# EAGLE design 32_ch_sample_and_hold_v2 (EAGLE 7.2.0)
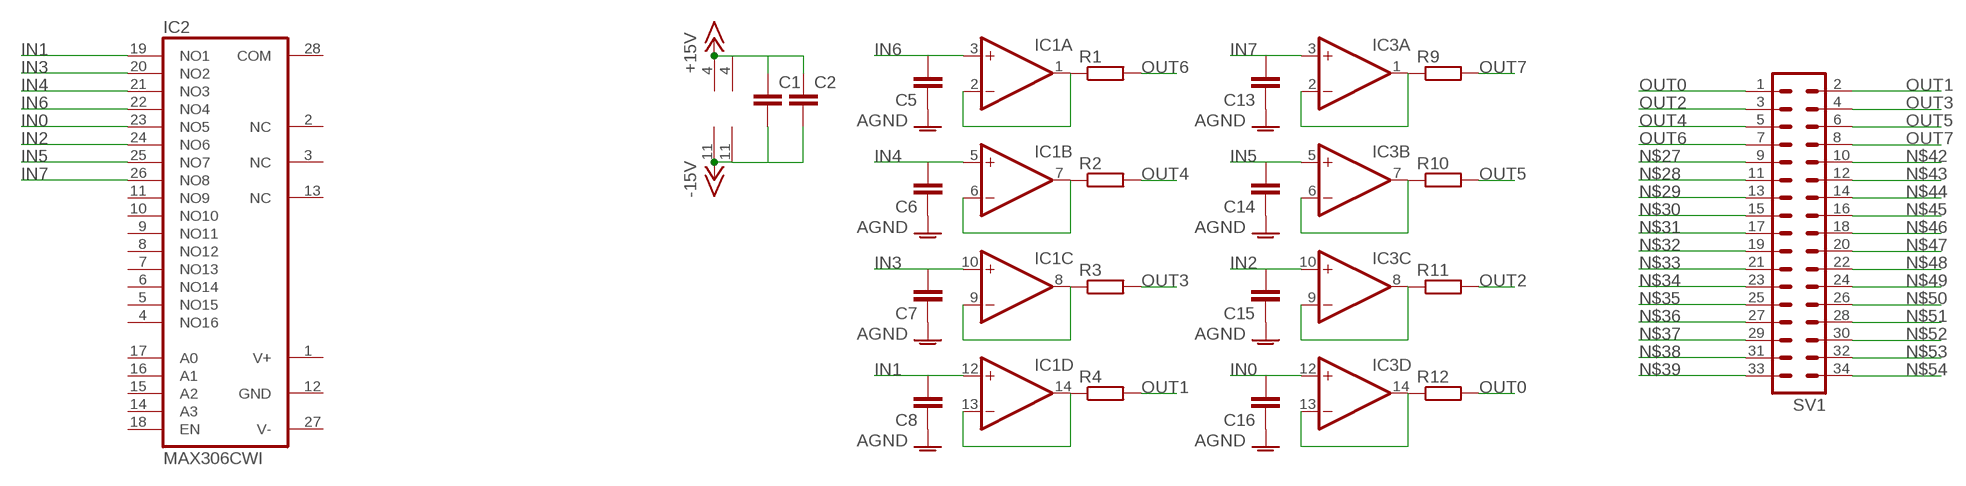
[diagram p0: schematic, sheet 1]

## Parts
C1  C-EUC0603  [C0603]
C2  C-EUC0603  [C0603]
C5  C-EUC1206  [C1206]
C6  C-EUC1206  [C1206]
C7  C-EUC1206  [C1206]
C8  C-EUC1206  [C1206]
C13  C-EUC1206  [C1206]
C14  C-EUC1206  [C1206]
C15  C-EUC1206  [C1206]
C16  C-EUC1206  [C1206]
IC1  TL074D  [SO14]
IC2  MAX306CWI  [SO28L]
IC3  TL074D  [SO14]
R1  R-EU_R0603  [R0603]
R2  R-EU_R0603  [R0603]
R3  R-EU_R0603  [R0603]
R4  R-EU_R0603  [R0603]
R9  R-EU_R0603  [R0603]
R10  R-EU_R0603  [R0603]
R11  R-EU_R0603  [R0603]
R12  R-EU_R0603  [R0603]
SV1  MA17-2  [MA17-2]

## Nets
+15V: C1.1 C2.1 IC1.4(P:V+) IC3.4(P:V+)
-15V: C1.2 C2.2 IC1.11(P:V-) IC3.11(P:V-)
AGND: C5.1 C6.1 C7.1 C8.1 C13.1 C14.1 C15.1 C16.1
IN0: C16.2 IC2.23(NO5) IC3.12(D:+IN)
IN1: C8.2 IC1.12(D:+IN) IC2.19(NO1)
IN2: C15.2 IC2.24(NO6) IC3.10(C:+IN)
IN3: C7.2 IC1.10(C:+IN) IC2.20(NO2)
IN4: C6.2 IC1.5(B:+IN) IC2.21(NO3)
IN5: C14.2 IC2.25(NO7) IC3.5(B:+IN)
IN6: C5.2 IC1.3(A:+IN) IC2.22(NO4)
IN7: C13.2 IC2.26(NO8) IC3.3(A:+IN)
N$1: IC1.1(A:OUT) IC1.2(A:-IN) R1.1
N$2: IC1.6(B:-IN) IC1.7(B:OUT) R2.1
N$3: IC1.8(C:OUT) IC1.9(C:-IN) R3.1
N$4: IC1.13(D:-IN) IC1.14(D:OUT) R4.1
N$9: IC3.1(A:OUT) IC3.2(A:-IN) R9.1
N$10: IC3.6(B:-IN) IC3.7(B:OUT) R10.1
N$11: IC3.8(C:OUT) IC3.9(C:-IN) R11.1
N$12: IC3.13(D:-IN) IC3.14(D:OUT) R12.1
N$27: SV1.9
N$28: SV1.11
N$29: SV1.13
N$30: SV1.15
N$31: SV1.17
N$32: SV1.19
N$33: SV1.21
N$34: SV1.23
N$35: SV1.25
N$36: SV1.27
N$37: SV1.29
N$38: SV1.31
N$39: SV1.33
N$42: SV1.10
N$43: SV1.12
N$44: SV1.14
N$45: SV1.16
N$46: SV1.18
N$47: SV1.20
N$48: SV1.22
N$49: SV1.24
N$50: SV1.26
N$51: SV1.28
N$52: SV1.30
N$53: SV1.32
N$54: SV1.34
OUT0: R12.2 SV1.1
OUT1: R4.2 SV1.2
OUT2: R11.2 SV1.3
OUT3: R3.2 SV1.4
OUT4: R2.2 SV1.5
OUT5: R10.2 SV1.6
OUT6: R1.2 SV1.7
OUT7: R9.2 SV1.8
Unconnected: IC2.2(NC) IC2.3(NC) IC2.4(NO16) IC2.5(NO15) IC2.6(NO14) IC2.7(NO13) IC2.8(NO12) IC2.9(NO11) IC2.10(NO10) IC2.11(NO9) IC2.13(NC) IC2.14(A3) IC2.15(A2) IC2.16(A1) IC2.17(A0) IC2.18(EN) IC2.28(COM)

## Power pins joined to a net without a drawn wire
GND: IC2.12(GND)
V+: IC2.1(V+)
V-: IC2.27(V-)

## Library data of the parts
C1 C2 C5-C8 C13-C16 = resistor:C-EU: CAPACITOR, European symbol
IC1 IC3 = linear:TL074: OP AMP
IC2 = maxim:MAX306CWI: MULTIPLEXER; MF: MAXIM; MPN: MAX306CWI; OC_FARNELL: unknown; OC_NEWARK: 90C2555
R1-R4 R9-R12 = resistor:R-EU_: RESISTOR, European symbol
SV1 = con-lstb:MA17-2: PIN HEADER; OC_FARNELL: unknown; OC_NEWARK: unknown

## Board
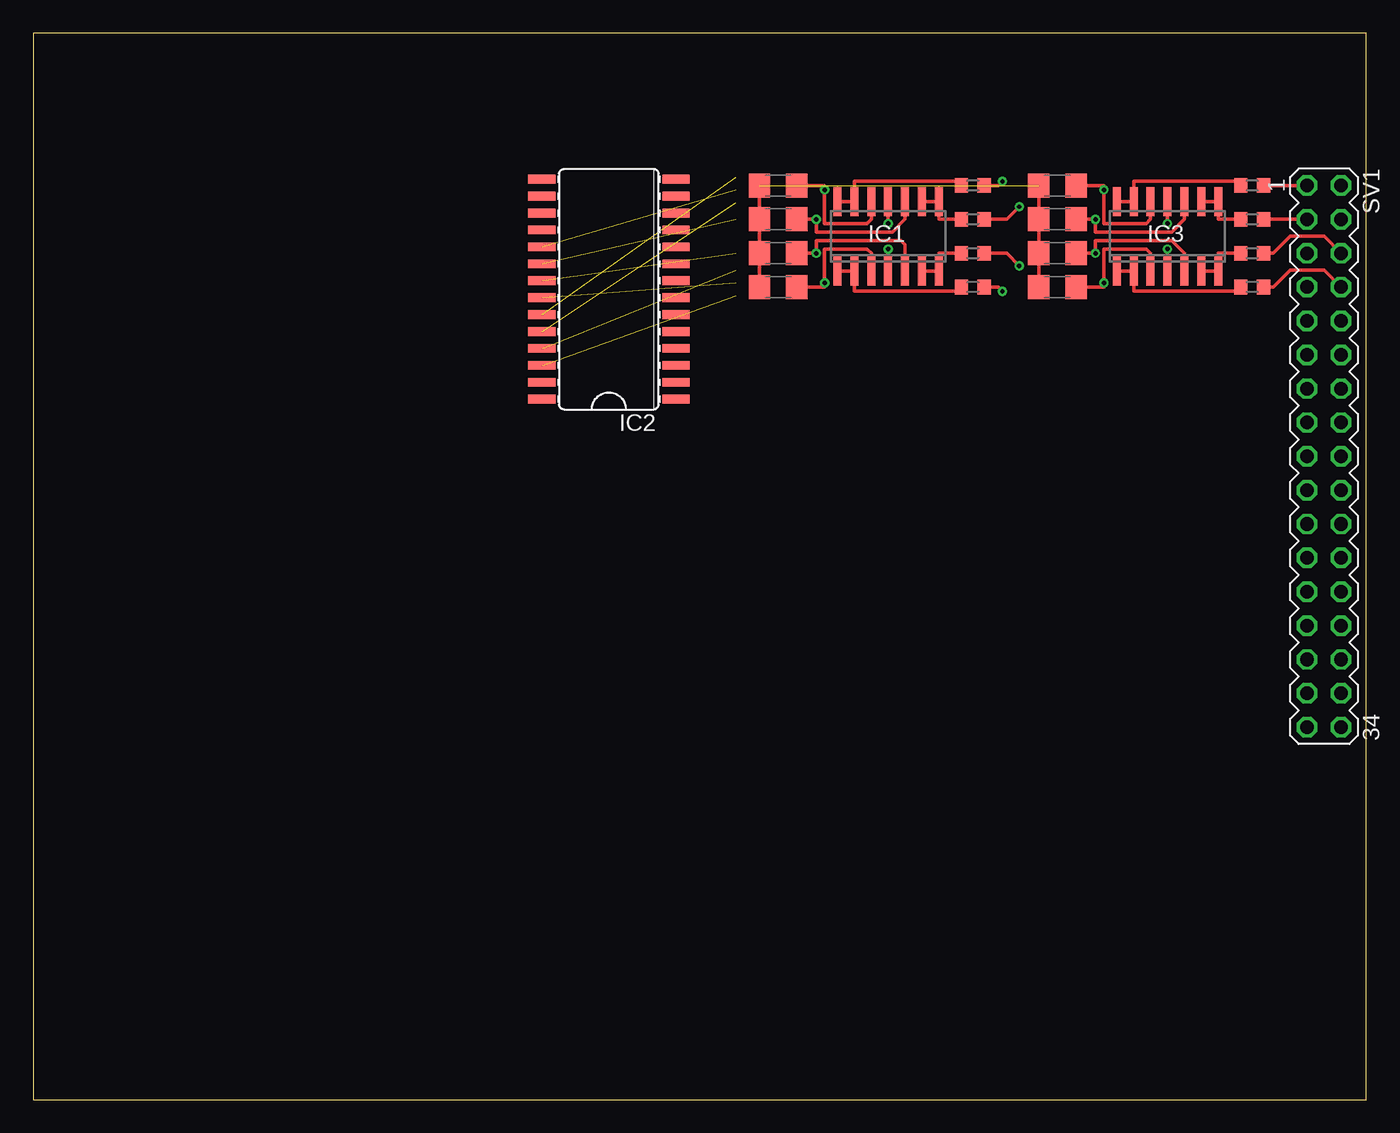
[diagram p1: board, top side]
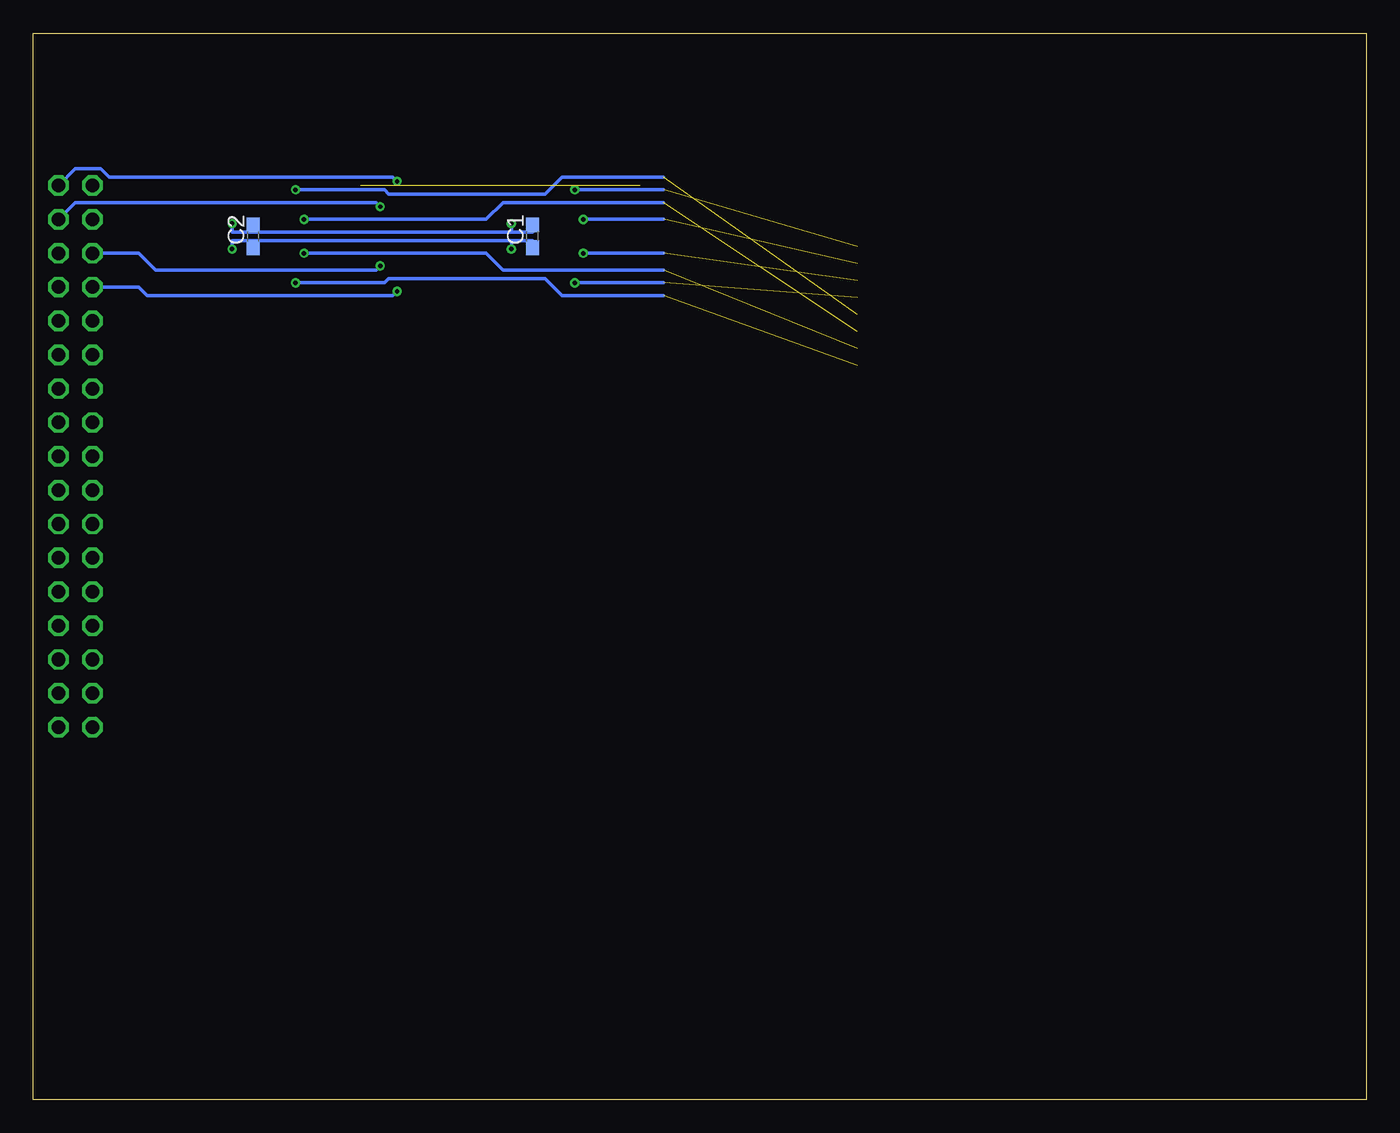
[diagram p2: board, bottom side, seen from below]

Size 100 x 80 mm. Coordinates in mm from the lower left corner, seen from the top.
Outline: 0,0 100,0 100,80 0,80 0,0
Copper layers (1*16): Top 0.0356mm / dielectric 1.5011mm / Bottom 0.0356mm
Design rules "LaenPCBOrder": minimum track width 6mil, minimum drill 13mil, track to track 6mil, track to pad 6mil, pad to pad 6mil, via to via 6mil, smd to smd 6mil, copper to edge 15mil, drill to drill 6mil, minimum pad ring 7mil, minimum via ring 7mil, stop-mask expansion 3mil, vias tented up to drill 0mil, thermal gap 10mil

### Footprints (pad centres in the part's own frame; a part is rotated, then mirrored left to right if it is on the bottom)
C0603 = smd 1.1 x 1: 1 -0.85,0; 2 0.85,0
C1206 = smd 1.6 x 1.8: 1 -1.4,0; 2 1.4,0
SO14 = smd 0.6 x 2.2: 1 -3.81,-2.6; 2 -2.54,-2.6; 3 -1.27,-2.6; 4 0,-2.6; 5 1.27,-2.6; 6 2.54,-2.6; 7 3.81,-2.6; 8 3.81,2.6; 9 2.54,2.6; 10 1.27,2.6; 11 0,2.6; 12 -1.27,2.6; 13 -2.54,2.6; 14 -3.81,2.6
SO28L = smd 0.66 x 2.032: 1 -8.255,-5.029; 2 -6.985,-5.029; 3 -5.715,-5.029; 4 -4.445,-5.029; 5 -3.175,-5.029; 6 -1.905,-5.029; 7 -0.635,-5.029; 8 0.635,-5.029; 9 1.905,-5.029; 10 3.175,-5.029; 11 4.445,-5.029; 12 5.715,-5.029; 13 6.985,-5.029; 14 8.255,-5.029; 15 8.255,5.029; 16 6.985,5.029; 17 5.715,5.029; 18 4.445,5.029; 19 3.175,5.029; 20 1.905,5.029; 21 0.635,5.029; 22 -0.635,5.029; 23 -1.905,5.029; 24 -3.175,5.029; 25 -4.445,5.029; 26 -5.715,5.029; 27 -6.985,5.029; 28 -8.255,5.029
R0603 = smd 1 x 1.1: 1 -0.85,0; 2 0.85,0
MA17-2 = drill 1.016 octagon: 1 -20.32,-1.27; 2 -20.32,1.27; 3 -17.78,-1.27; 4 -17.78,1.27; 5 -15.24,-1.27; 6 -15.24,1.27; 7 -12.7,-1.27; 8 -12.7,1.27; 9 -10.16,-1.27; 10 -10.16,1.27; 11 -7.62,-1.27; 12 -7.62,1.27; 13 -5.08,-1.27; 14 -5.08,1.27; 15 -2.54,-1.27; 16 -2.54,1.27; 17 0,-1.27; 18 0,1.27; 19 2.54,-1.27; 20 2.54,1.27; 21 5.08,-1.27; 22 5.08,1.27; 23 7.62,-1.27; 24 7.62,1.27; 25 10.16,-1.27; 26 10.16,1.27; 27 12.7,-1.27; 28 12.7,1.27; 29 15.24,-1.27; 30 15.24,1.27; 31 17.78,-1.27; 32 17.78,1.27; 33 20.32,-1.27; 34 20.32,1.27

### Placement (x,y rotation side)
C1  62.55,64.77 90 bottom
C2  83.5,64.77 90 bottom
C5  55.88,60.96 0 top
C6  55.88,63.5 0 top
C7  55.88,66.04 0 top
C8  55.88,68.58 0 top
C13  76.83,60.96 0 top
C14  76.83,63.5 0 top
C15  76.83,66.04 0 top
C16  76.83,68.58 0 top
IC1  64.14,64.77 0 top
IC2  43.18,60.8 90 top
IC3  85.09,64.77 0 top
R1  70.48,60.96 0 top
R2  70.48,63.5 0 top
R3  70.48,66.04 0 top
R4  70.48,68.58 0 top
R9  91.44,60.96 0 top
R10  91.44,63.5 0 top
R11  91.44,66.04 0 top
R12  91.44,68.58 0 top
SV1  96.84,48.26 270 top

### Tracks (layer width: path | path; a pad name or v marks a point on that pad's centre or on a via)
+15V  (via drill 0.33)
  Top 0.254: IC3.4 v85.09,63.82 | v64.14,63.82 IC1.4
  Bottom 0.254: v85.09,63.82 85.09,64.45 83.5,64.45 | C2.1 83.5,64.45 | 83.5,64.45 64.14,64.45 | 64.14,64.45 v64.14,63.82 | C1.1 62.55,64.45 64.14,64.45
-15V  (via drill 0.33)
  Top 0.254: IC1.11 v64.14,65.72 | v85.09,65.72 IC3.11
  Bottom 0.254: 64.14,65.09 62.55,65.09 C1.2 | v64.14,65.72 64.14,65.09 | 64.14,65.09 83.5,65.09 | C2.2 83.5,65.09 | 83.5,65.09 85.09,65.09 v85.09,65.72
AGND  (1 unrouted)
  Top 0.254: C16.1 C15.1 C14.1 C13.1 | C8.1 C7.1 C6.1 C5.1
IN0  (via drill 0.33)  (1 unrouted)
  Top 0.254: IC3.12 83.82,66.04 83.5,65.72 80.33,65.72 v80.33,68.26 80.33,68.58 C16.2
  Bottom 0.254: v80.33,68.26 73.66,68.26 73.34,67.94 61.59,67.94 60.33,69.22 52.7,69.22
IN1  (via drill 0.33)  (1 unrouted)
  Top 0.254: IC1.12 62.87,66.04 62.55,65.72 59.37,65.72 v59.37,68.26 59.37,68.58 C8.2
  Bottom 0.254: v59.37,68.26 52.7,68.26
IN2  (via drill 0.33)  (1 unrouted)
  Top 0.254: C15.2 78.87,65.91 78.74,66.04 v79.69,66.04 79.69,65.09 85.41,65.09 86.36,66.04 IC3.10
  Bottom 0.254: v79.69,66.04 66.04,66.04 64.77,67.31 52.7,67.31
IN3  (via drill 0.33)  (1 unrouted)
  Top 0.254: IC1.10 65.41,66.04 64.45,65.09 58.74,65.09 v58.74,66.04 C7.2
  Bottom 0.254: v58.74,66.04 52.7,66.04
IN4  (via drill 0.33)  (1 unrouted)
  Top 0.254: 57.91,63.63 C6.2 v58.74,63.5 58.74,64.45 65.09,64.45 65.41,64.14 IC1.5
  Bottom 0.254: v58.74,63.5 52.7,63.5
IN5  (via drill 0.33)  (1 unrouted)
  Top 0.254: 78.87,63.63 C14.2 v79.69,63.5 79.69,64.45 85.41,64.45 86.36,63.5 IC3.5
  Bottom 0.254: v79.69,63.5 66.04,63.5 64.77,62.23 52.7,62.23
IN6  (via drill 0.33)  (1 unrouted)
  Top 0.254: C5.2 59.37,60.96 v59.37,61.28 59.37,63.82 62.55,63.82 62.87,63.5 IC1.3
  Bottom 0.254: v59.37,61.28 52.7,61.28
IN7  (via drill 0.33)  (1 unrouted)
  Top 0.254: IC3.3 83.82,63.5 83.5,63.82 80.33,63.82 v80.33,61.28 80.33,60.96 C13.2
  Bottom 0.254: v80.33,61.28 73.66,61.28 73.34,61.59 61.59,61.59 60.33,60.33 52.7,60.33
N$1
  Top 0.254: IC1.1 IC1.2 61.59,60.64 69.53,60.64 69.53,61.28 R1.1
N$2
  Top 0.254: IC1.6 IC1.7 67.94,63.5 R2.1
N$3
  Top 0.254: IC1.8 67.94,68.36 | IC1.9 IC1.8 | IC1.8 67.94,66.04 R3.1
N$4
  Top 0.254: 60.33,68.36 IC1.14 IC1.13 61.59,68.9 69.53,68.9 69.53,68.26 R4.1
N$9
  Top 0.254: IC3.1 IC3.2 82.55,60.64 90.49,60.64 90.49,61.17 R9.1
N$10
  Top 0.254: IC3.6 IC3.7 88.9,63.5 R10.1
N$11
  Top 0.254: IC3.9 IC3.8 88.9,66.04 R11.1
N$12
  Top 0.254: IC3.14 IC3.13 82.55,68.9 90.49,68.9 90.49,68.26 R12.1
OUT0
  Top 0.254: R12.2 SV1.1
OUT1  (via drill 0.33)
  Top 0.254: R4.2 72.39,68.58 v72.71,68.9
  Bottom 0.254: v72.71,68.9 73.03,69.22 94.3,69.22 94.93,69.85 96.84,69.85 SV1.2
OUT2
  Top 0.254: R11.2 SV1.3
OUT3  (via drill 0.33)
  Top 0.254: R3.2 73.03,66.04 v73.98,66.99
  Bottom 0.254: v73.98,66.99 74.3,67.31 96.84,67.31 SV1.4
OUT4  (via drill 0.33)
  Top 0.254: R2.2 73.03,63.5 v73.98,62.55
  Bottom 0.254: v73.98,62.55 74.3,62.23 90.81,62.23 92.08,63.5 SV1.5
OUT5
  Top 0.254: R10.2 93.03,63.5 94.3,64.77 96.84,64.77 SV1.6
OUT6  (via drill 0.33)
  Top 0.254: R1.2 72.39,60.96 v72.71,60.64
  Bottom 0.254: v72.71,60.64 73.03,60.33 91.44,60.33 92.08,60.96 SV1.7
OUT7
  Top 0.254: R9.2 93.03,60.96 94.3,62.23 96.84,62.23 SV1.8